# Altium schematic sheet 0_Overview.SchDoc: Overview
size A3; DocumentNumber: 1; SheetNumber: 1; SheetTotal: 6; PageSetup: Record=PageOptions|CenterHorizontal=True|CenterVertical=True|PrintScale=1.01|XCorrection=1.00|YCorrection=1.00|PrintKind=0|BorderSize=5000000|LeftOffset=0|BottomOffset=0|Orientation=2|PaperLength=1000|PaperWidth=1000|Scale=100|PaperSource=7|PrintQuality=-4|MediaType=1|DitherType=10|PaperKind=A3|PrintScaleMode=1
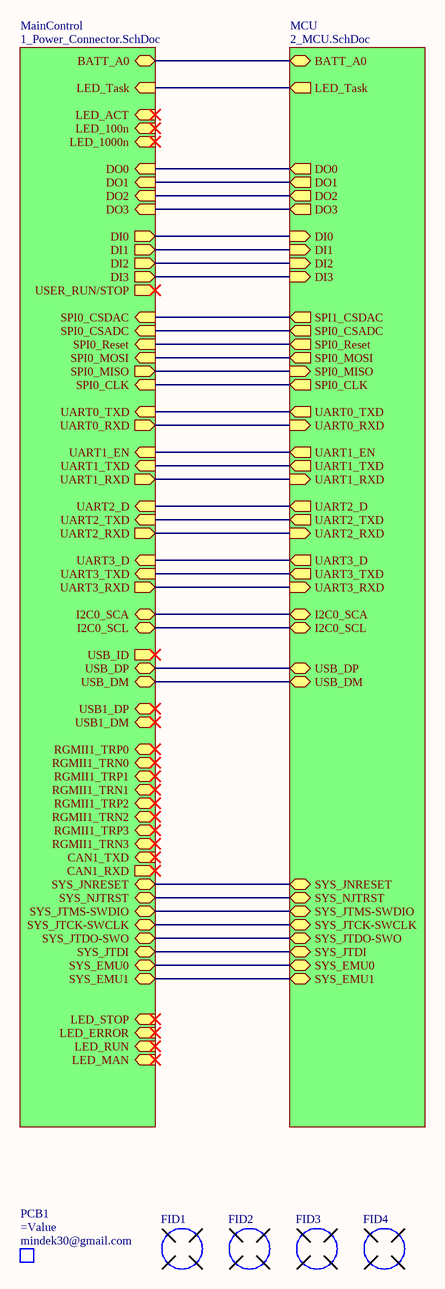
[diagram p0: 0_Overview.SchDoc]

## Parts
FID1  FIDUCIAL  [FID]  (value not drawn)  (no BOM)
FID2  FIDUCIAL  [FID]  (value not drawn)  (no BOM)
FID3  FIDUCIAL  [FID]  (value not drawn)  (no BOM)
FID4  FIDUCIAL  [FID]  (value not drawn)  (no BOM)
PCB1  Manufacturer: mindek30@gmail.com  (mechanical)

## Sub-sheets
MainControl = 1_Power_Connector.SchDoc: BATT_A0 (bidir), LED_Task (in), RGMII1_TRP1 (bidir), RGMII1_TRN3 (bidir), RGMII1_TRN0 (bidir), RGMII1_TRP3 (bidir), RGMII1_TRN2 (bidir), RGMII1_TRN1 (bidir), RGMII1_TRP2 (bidir), RGMII1_TRP0 (bidir), USB_DP (bidir), USB_DM (bidir), USB1_DP (bidir), USB1_DM (bidir), USB_ID (out), I2C0_SCA (bidir), I2C0_SCL (bidir), UART3_TXD (in), UART3_D (in), UART3_RXD (out), UART1_RXD (out), UART2_TXD (in), UART1_TXD (in), UART1_EN (in), UART2_RXD (out), UART2_D (in), UART0_TXD (in), UART0_RXD (out), SPI0_MISO (out), SPI0_CLK (in), SPI0_MOSI (in), SPI0_CSADC (in), SPI0_Reset (in), LED_ACT (in), LED_100n (in), LED_1000n (in), DO1 (in), DO0 (in), DO3 (in), DO2 (in), DI3 (out), DI1 (out), DI2 (out), DI0 (out), SYS_JTCK-SWCLK (bidir), SYS_JTDI (bidir), SYS_JTDO-SWO (bidir), SYS_EMU1 (bidir), SYS_EMU0 (bidir), SYS_JNRESET (bidir), SYS_NJTRST (bidir), SYS_JTMS-SWDIO (bidir), CAN1_TXD (in), CAN1_RXD (out), SPI0_CSDAC (in), USER_RUN/STOP (out), LED_STOP (in), LED_ERROR (in), LED_RUN (in), LED_MAN (in)
MCU = 2_MCU.SchDoc: BATT_A0 (bidir), LED_Task (out), DO0 (out), DO1 (out), DO2 (out), DO3 (out), DI0 (in), DI1 (in), DI2 (in), DI3 (in), SPI0_CSADC (out), SPI0_Reset (out), SPI0_MOSI (out), SPI0_MISO (in), SPI0_CLK (out), UART0_TXD (out), UART0_RXD (in), UART1_EN (out), UART1_TXD (out), UART1_RXD (in), UART2_D (out), UART2_TXD (out), UART2_RXD (in), UART3_D (out), UART3_TXD (out), UART3_RXD (in), I2C0_SCA (bidir), I2C0_SCL (bidir), SYS_JNRESET (bidir), SYS_NJTRST (bidir), SYS_JTMS-SWDIO (bidir), SYS_JTCK-SWCLK (bidir), SYS_JTDO-SWO (bidir), SYS_JTDI (bidir), SYS_EMU0 (bidir), SYS_EMU1 (bidir), USB_DP (bidir), USB_DM (bidir), SPI1_CSDAC (out)

## Nets
(unnamed): sheet MainControl/BATT_A0, sheet MCU/BATT_A0
(unnamed): sheet MainControl/LED_Task, sheet MCU/LED_Task
(unnamed): sheet MainControl/USB_DP, sheet MCU/USB_DP
(unnamed): sheet MainControl/USB_DM, sheet MCU/USB_DM
(unnamed): sheet MainControl/I2C0_SCA, sheet MCU/I2C0_SCA
(unnamed): sheet MainControl/I2C0_SCL, sheet MCU/I2C0_SCL
(unnamed): sheet MainControl/UART3_TXD, sheet MCU/UART3_TXD
(unnamed): sheet MainControl/UART3_D, sheet MCU/UART3_D
(unnamed): sheet MainControl/UART3_RXD, sheet MCU/UART3_RXD
(unnamed): sheet MainControl/UART1_RXD, sheet MCU/UART1_RXD
(unnamed): sheet MainControl/UART2_TXD, sheet MCU/UART2_TXD
(unnamed): sheet MainControl/UART1_TXD, sheet MCU/UART1_TXD
(unnamed): sheet MainControl/UART1_EN, sheet MCU/UART1_EN
(unnamed): sheet MainControl/UART2_RXD, sheet MCU/UART2_RXD
(unnamed): sheet MainControl/UART2_D, sheet MCU/UART2_D
(unnamed): sheet MainControl/UART0_TXD, sheet MCU/UART0_TXD
(unnamed): sheet MainControl/UART0_RXD, sheet MCU/UART0_RXD
(unnamed): sheet MainControl/SPI0_MISO, sheet MCU/SPI0_MISO
(unnamed): sheet MainControl/SPI0_CLK, sheet MCU/SPI0_CLK
(unnamed): sheet MainControl/SPI0_MOSI, sheet MCU/SPI0_MOSI
(unnamed): sheet MainControl/SPI0_CSADC, sheet MCU/SPI0_CSADC
(unnamed): sheet MainControl/SPI0_Reset, sheet MCU/SPI0_Reset
(unnamed): sheet MainControl/DO1, sheet MCU/DO1
(unnamed): sheet MainControl/DO0, sheet MCU/DO0
(unnamed): sheet MainControl/DO3, sheet MCU/DO3
(unnamed): sheet MainControl/DO2, sheet MCU/DO2
(unnamed): sheet MainControl/DI3, sheet MCU/DI3
(unnamed): sheet MainControl/DI1, sheet MCU/DI1
(unnamed): sheet MainControl/DI2, sheet MCU/DI2
(unnamed): sheet MainControl/DI0, sheet MCU/DI0
(unnamed): sheet MainControl/SYS_JTCK-SWCLK, sheet MCU/SYS_JTCK-SWCLK
(unnamed): sheet MainControl/SYS_JTDI, sheet MCU/SYS_JTDI
(unnamed): sheet MainControl/SYS_JTDO-SWO, sheet MCU/SYS_JTDO-SWO
(unnamed): sheet MainControl/SYS_EMU1, sheet MCU/SYS_EMU1
(unnamed): sheet MainControl/SYS_EMU0, sheet MCU/SYS_EMU0
(unnamed): sheet MainControl/SYS_JNRESET, sheet MCU/SYS_JNRESET
(unnamed): sheet MainControl/SYS_NJTRST, sheet MCU/SYS_NJTRST
(unnamed): sheet MainControl/SYS_JTMS-SWDIO, sheet MCU/SYS_JTMS-SWDIO
(unnamed): sheet MainControl/SPI0_CSDAC, sheet MCU/SPI1_CSDAC

## Notes on the sheet
- Title :
- Revision :
- ผู้จัดทำ:
- Size:
- A3
- Time:
- ผู้เขียน:
- บริษัท ยูนิเวอร์แซล ยูทีลิตี้ส์ จำกัด (มหาชน) เลขที่ 1 อาคาร อีสท์วอเตอร์ ชั้น 18 ซอยวิภาวดีรังสิต 5 แขวงจอมพล เขตจตุจักร กรุงเทพฯ 10900
  Tel : +662-272-1688
  Fax :+662-2721690-1
- -
- Sheet:
- of
- ผู้อำนวยการ
- ผู้ตรวจสอบ:
- Number:
- กรรมการผู้จัดการ:
- File:

## Library data of the parts
FID1-FID4 = FID_FIDUCIAL: Manufacturer: mindek30@gmail.com; Value2: Non SE; Value: Non SE; PartNumber: =PCB_PN+'_'+PCB_Rev; PartID: =PCB_Rev; PackageReference: Non SE; Value3: Non SE
PCB1 = PCB_Bare: BARE PCB; PartNumber: =PCB_PN+'_'+PCB_Rev; PackageReference: Non SE; PartID: =PCB_Rev; Value2: =JobFile_Title; Value: =PartNumber; Value3: =PCBA_PN+'_'+PCBA_Rev